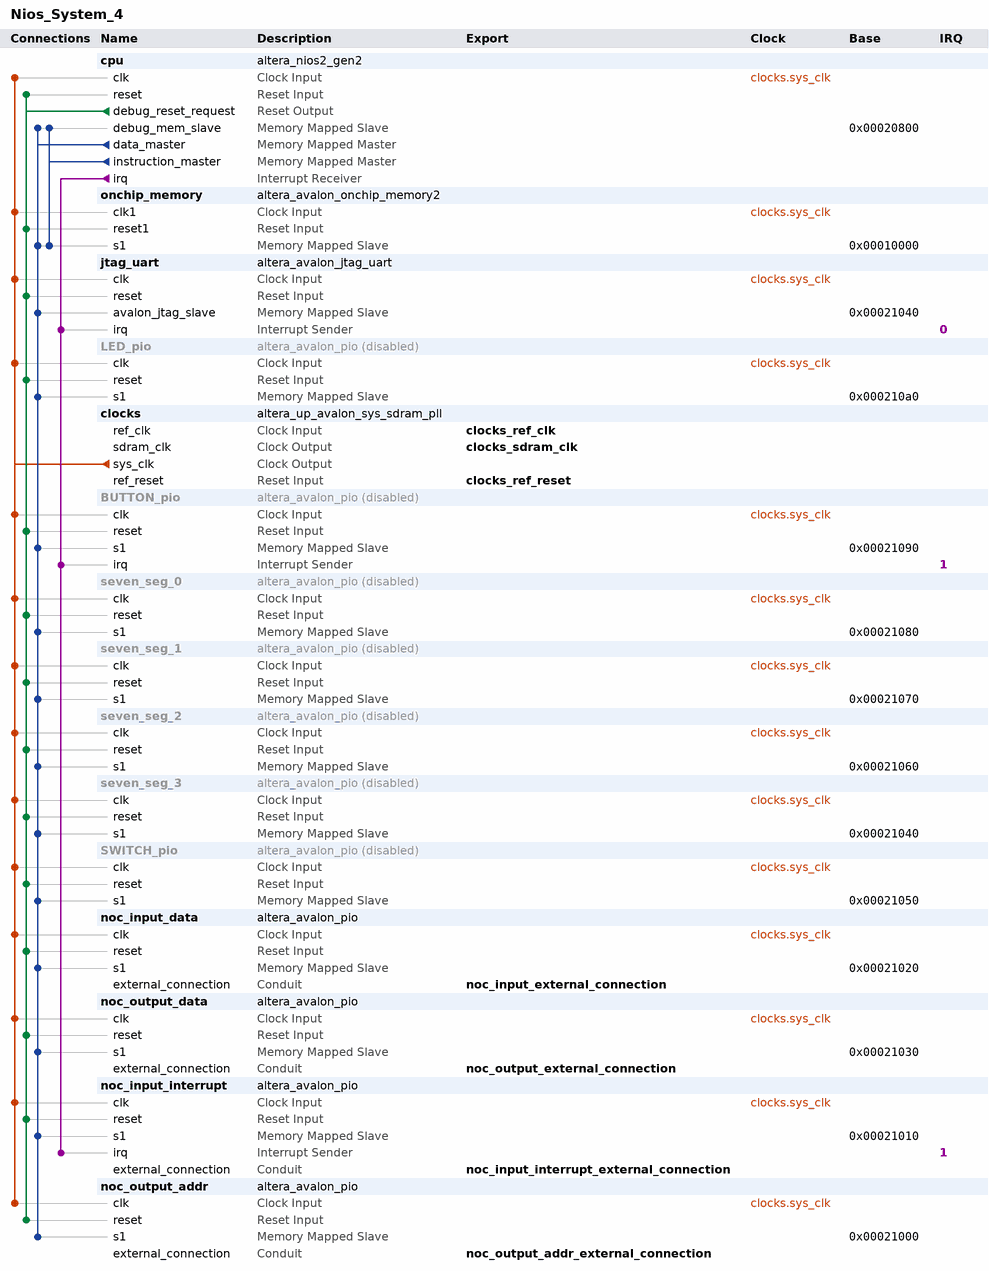
[diagram p0: system contents]
# Platform Designer (Qsys) system Nios_System_4, Cyclone V 5CSEMA5F31C6
# Parameters at their usual value, and those the tool derives, are not listed.
package require -exact qsys 18.1
create_system Nios_System_4
set_project_property DEVICE_FAMILY {Cyclone V}
set_project_property DEVICE 5CSEMA5F31C6

add_instance cpu altera_nios2_gen2 18.1
set_instance_parameter_value cpu cpuID 1
set_instance_parameter_value cpu dcache_size 1024
set_instance_parameter_value cpu exceptionSlave onchip_memory.s1
set_instance_parameter_value cpu icache_size 512
set_instance_parameter_value cpu impl Fast
set_instance_parameter_value cpu resetSlave onchip_memory.s1

add_instance onchip_memory altera_avalon_onchip_memory2 18.1
set_instance_parameter_value onchip_memory dataWidth 32
set_instance_parameter_value onchip_memory dualPort false
set_instance_parameter_value onchip_memory initMemContent true
set_instance_parameter_value onchip_memory initializationFileName onchip_mem.hex
set_instance_parameter_value onchip_memory memorySize 40960

add_instance jtag_uart altera_avalon_jtag_uart 18.1
set_instance_parameter_value jtag_uart simInteractiveOptions NO_INTERACTIVE_WINDOWS

add_instance LED_pio altera_avalon_pio 18.1
set_instance_property LED_pio ENABLED false
set_instance_parameter_value LED_pio direction Output
set_instance_parameter_value LED_pio width 10

add_instance clocks altera_up_avalon_sys_sdram_pll 18.0
set_instance_parameter_value clocks CV_boards DE1-SoC
set_instance_parameter_value clocks gui_outclk 50.0
set_instance_parameter_value clocks gui_refclk 50.0

add_instance BUTTON_pio altera_avalon_pio 18.1
set_instance_property BUTTON_pio ENABLED false
set_instance_parameter_value BUTTON_pio captureEdge true
set_instance_parameter_value BUTTON_pio direction Input
set_instance_parameter_value BUTTON_pio generateIRQ true
set_instance_parameter_value BUTTON_pio irqType EDGE
set_instance_parameter_value BUTTON_pio width 4

add_instance seven_seg_0 altera_avalon_pio 18.1
set_instance_property seven_seg_0 ENABLED false
set_instance_parameter_value seven_seg_0 direction Output
set_instance_parameter_value seven_seg_0 width 7

add_instance seven_seg_1 altera_avalon_pio 18.1
set_instance_property seven_seg_1 ENABLED false
set_instance_parameter_value seven_seg_1 direction Output
set_instance_parameter_value seven_seg_1 width 7

add_instance seven_seg_2 altera_avalon_pio 18.1
set_instance_property seven_seg_2 ENABLED false
set_instance_parameter_value seven_seg_2 direction Output
set_instance_parameter_value seven_seg_2 width 7

add_instance seven_seg_3 altera_avalon_pio 18.1
set_instance_property seven_seg_3 ENABLED false
set_instance_parameter_value seven_seg_3 direction Output
set_instance_parameter_value seven_seg_3 width 7

add_instance SWITCH_pio altera_avalon_pio 18.1
set_instance_property SWITCH_pio ENABLED false
set_instance_parameter_value SWITCH_pio direction Input
set_instance_parameter_value SWITCH_pio width 10

add_instance noc_input_data altera_avalon_pio 18.1
set_instance_parameter_value noc_input_data direction Input
set_instance_parameter_value noc_input_data width 32

add_instance noc_output_data altera_avalon_pio 18.1
set_instance_parameter_value noc_output_data direction Output
set_instance_parameter_value noc_output_data width 32

add_instance noc_input_interrupt altera_avalon_pio 18.1
set_instance_parameter_value noc_input_interrupt direction Input
set_instance_parameter_value noc_input_interrupt generateIRQ true
set_instance_parameter_value noc_input_interrupt width 1

add_instance noc_output_addr altera_avalon_pio 18.1
set_instance_parameter_value noc_output_addr direction Output
set_instance_parameter_value noc_output_addr width 8

# connections
add_connection clocks.sys_clk BUTTON_pio.clk clock
add_connection clocks.sys_clk cpu.clk clock
add_connection clocks.sys_clk jtag_uart.clk clock
add_connection clocks.sys_clk LED_pio.clk clock
add_connection clocks.sys_clk noc_input_data.clk clock
add_connection clocks.sys_clk noc_input_interrupt.clk clock
add_connection clocks.sys_clk noc_output_addr.clk clock
add_connection clocks.sys_clk noc_output_data.clk clock
add_connection clocks.sys_clk onchip_memory.clk1 clock
add_connection clocks.sys_clk seven_seg_0.clk clock
add_connection clocks.sys_clk seven_seg_1.clk clock
add_connection clocks.sys_clk seven_seg_2.clk clock
add_connection clocks.sys_clk seven_seg_3.clk clock
add_connection clocks.sys_clk SWITCH_pio.clk clock
add_connection cpu.debug_reset_request BUTTON_pio.reset reset
add_connection cpu.debug_reset_request cpu.reset reset
add_connection cpu.debug_reset_request jtag_uart.reset reset
add_connection cpu.debug_reset_request LED_pio.reset reset
add_connection cpu.debug_reset_request noc_input_data.reset reset
add_connection cpu.debug_reset_request noc_input_interrupt.reset reset
add_connection cpu.debug_reset_request noc_output_addr.reset reset
add_connection cpu.debug_reset_request noc_output_data.reset reset
add_connection cpu.debug_reset_request onchip_memory.reset1 reset
add_connection cpu.debug_reset_request seven_seg_0.reset reset
add_connection cpu.debug_reset_request seven_seg_1.reset reset
add_connection cpu.debug_reset_request seven_seg_2.reset reset
add_connection cpu.debug_reset_request seven_seg_3.reset reset
add_connection cpu.debug_reset_request SWITCH_pio.reset reset
add_connection cpu.data_master BUTTON_pio.s1 avalon
set_connection_parameter_value cpu.data_master/BUTTON_pio.s1 baseAddress 0x00021090
add_connection cpu.data_master cpu.debug_mem_slave avalon
set_connection_parameter_value cpu.data_master/cpu.debug_mem_slave baseAddress 0x00020800
add_connection cpu.data_master jtag_uart.avalon_jtag_slave avalon
set_connection_parameter_value cpu.data_master/jtag_uart.avalon_jtag_slave baseAddress 0x00021040
add_connection cpu.data_master LED_pio.s1 avalon
set_connection_parameter_value cpu.data_master/LED_pio.s1 baseAddress 0x000210a0
add_connection cpu.data_master noc_input_data.s1 avalon
set_connection_parameter_value cpu.data_master/noc_input_data.s1 baseAddress 0x00021020
add_connection cpu.data_master noc_input_interrupt.s1 avalon
set_connection_parameter_value cpu.data_master/noc_input_interrupt.s1 baseAddress 0x00021010
add_connection cpu.data_master noc_output_addr.s1 avalon
set_connection_parameter_value cpu.data_master/noc_output_addr.s1 baseAddress 0x00021000
add_connection cpu.data_master noc_output_data.s1 avalon
set_connection_parameter_value cpu.data_master/noc_output_data.s1 baseAddress 0x00021030
add_connection cpu.data_master onchip_memory.s1 avalon
set_connection_parameter_value cpu.data_master/onchip_memory.s1 baseAddress 0x00010000
add_connection cpu.data_master seven_seg_0.s1 avalon
set_connection_parameter_value cpu.data_master/seven_seg_0.s1 baseAddress 0x00021080
add_connection cpu.data_master seven_seg_1.s1 avalon
set_connection_parameter_value cpu.data_master/seven_seg_1.s1 baseAddress 0x00021070
add_connection cpu.data_master seven_seg_2.s1 avalon
set_connection_parameter_value cpu.data_master/seven_seg_2.s1 baseAddress 0x00021060
add_connection cpu.data_master seven_seg_3.s1 avalon
set_connection_parameter_value cpu.data_master/seven_seg_3.s1 baseAddress 0x00021040
add_connection cpu.data_master SWITCH_pio.s1 avalon
set_connection_parameter_value cpu.data_master/SWITCH_pio.s1 baseAddress 0x00021050
add_connection cpu.instruction_master cpu.debug_mem_slave avalon
set_connection_parameter_value cpu.instruction_master/cpu.debug_mem_slave baseAddress 0x00020800
add_connection cpu.instruction_master onchip_memory.s1 avalon
set_connection_parameter_value cpu.instruction_master/onchip_memory.s1 baseAddress 0x00010000
add_connection cpu.irq BUTTON_pio.irq interrupt
set_connection_parameter_value cpu.irq/BUTTON_pio.irq irqNumber 1
add_connection cpu.irq jtag_uart.irq interrupt
set_connection_parameter_value cpu.irq/jtag_uart.irq irqNumber 0
add_connection cpu.irq noc_input_interrupt.irq interrupt
set_connection_parameter_value cpu.irq/noc_input_interrupt.irq irqNumber 1

# exported interfaces
add_interface clocks_ref_clk clock sink
set_interface_property clocks_ref_clk EXPORT_OF clocks.ref_clk
add_interface clocks_ref_reset reset sink
set_interface_property clocks_ref_reset EXPORT_OF clocks.ref_reset
add_interface clocks_sdram_clk clock source
set_interface_property clocks_sdram_clk EXPORT_OF clocks.sdram_clk
add_interface noc_input_external_connection conduit end
set_interface_property noc_input_external_connection EXPORT_OF noc_input_data.external_connection
add_interface noc_input_interrupt_external_connection conduit end
set_interface_property noc_input_interrupt_external_connection EXPORT_OF noc_input_interrupt.external_connection
add_interface noc_output_addr_external_connection conduit end
set_interface_property noc_output_addr_external_connection EXPORT_OF noc_output_addr.external_connection
add_interface noc_output_external_connection conduit end
set_interface_property noc_output_external_connection EXPORT_OF noc_output_data.external_connection

set_interconnect_requirement {$system} qsys_mm.clockCrossingAdapter HANDSHAKE
set_interconnect_requirement {$system} qsys_mm.enableEccProtection FALSE
set_interconnect_requirement {$system} qsys_mm.insertDefaultSlave FALSE
set_interconnect_requirement {$system} qsys_mm.maxAdditionalLatency 1

save_system Nios_System_4.qsys
